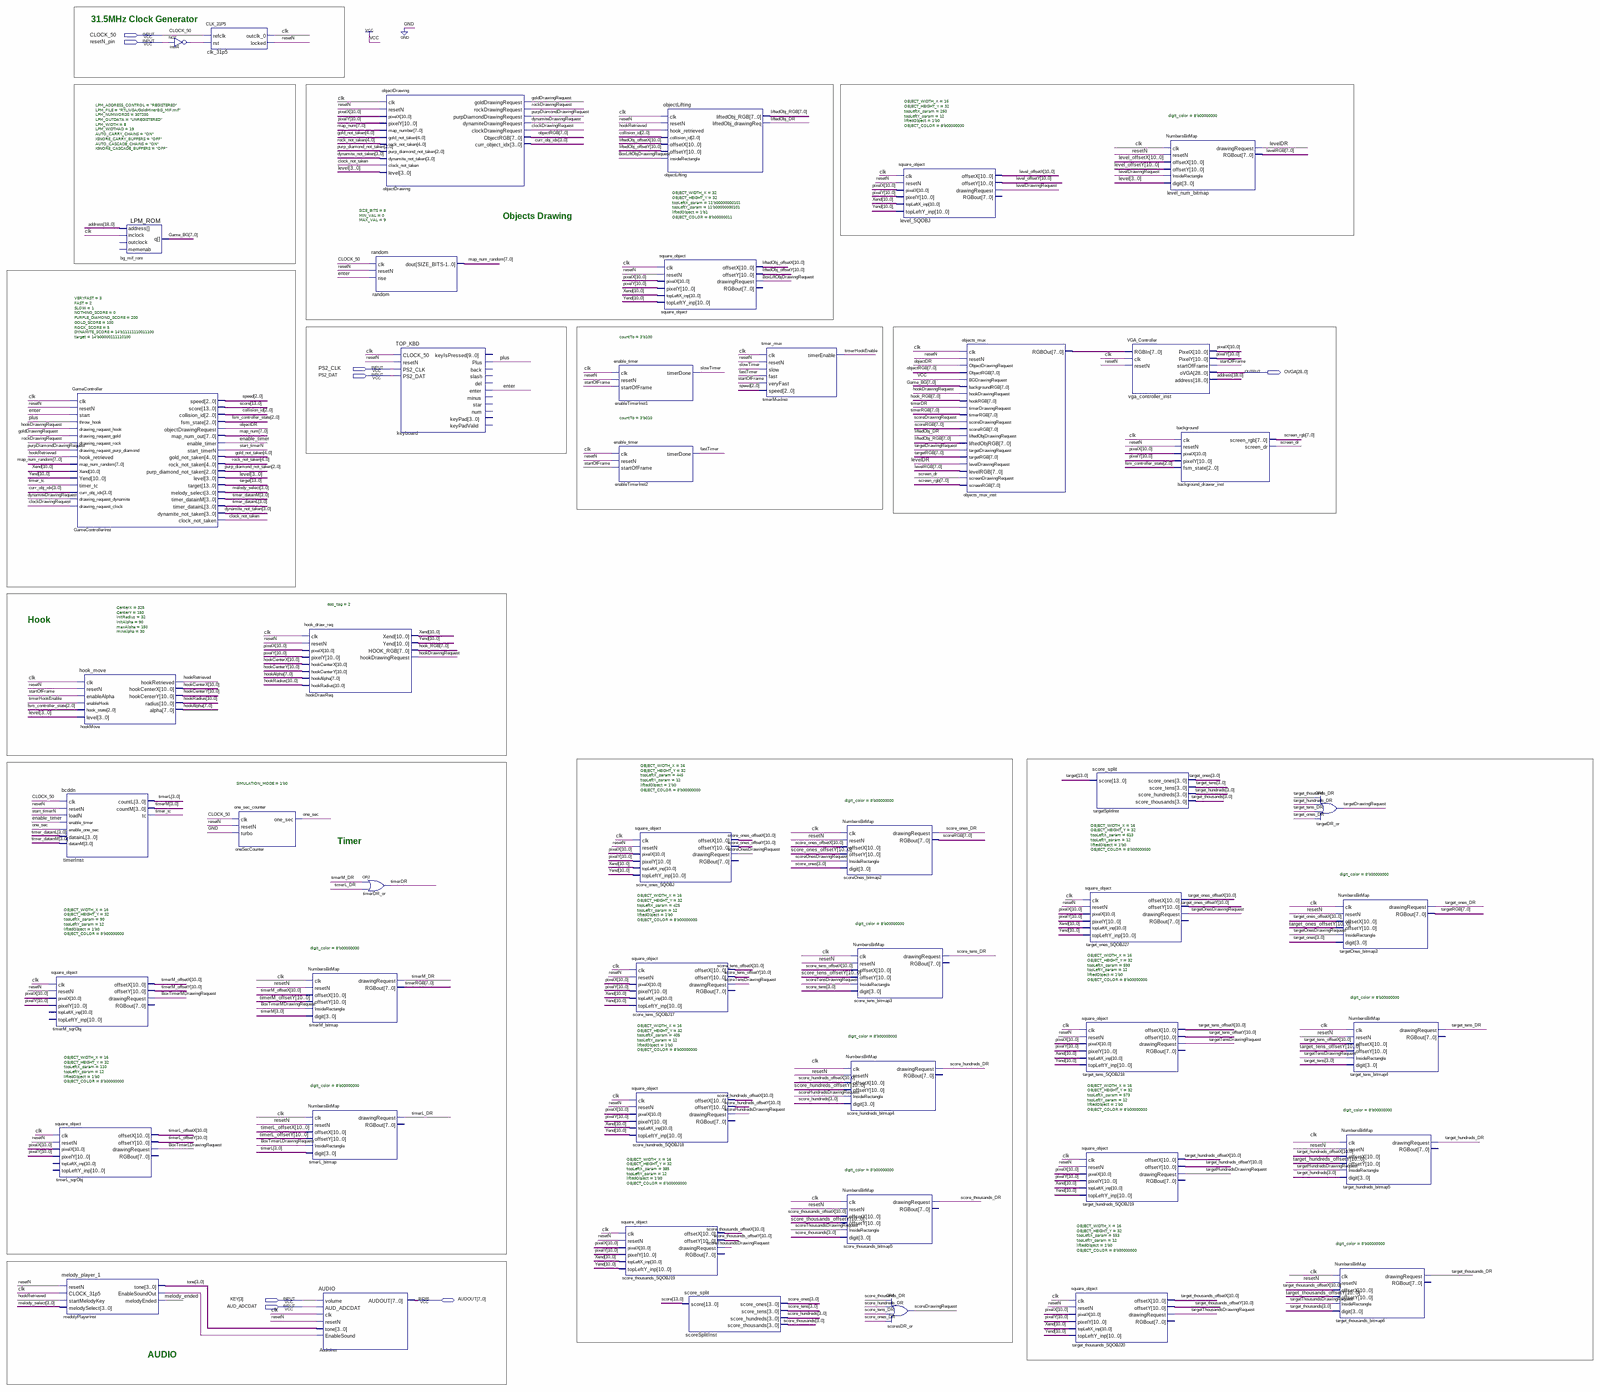
[diagram p0: schematic sheet, whole]
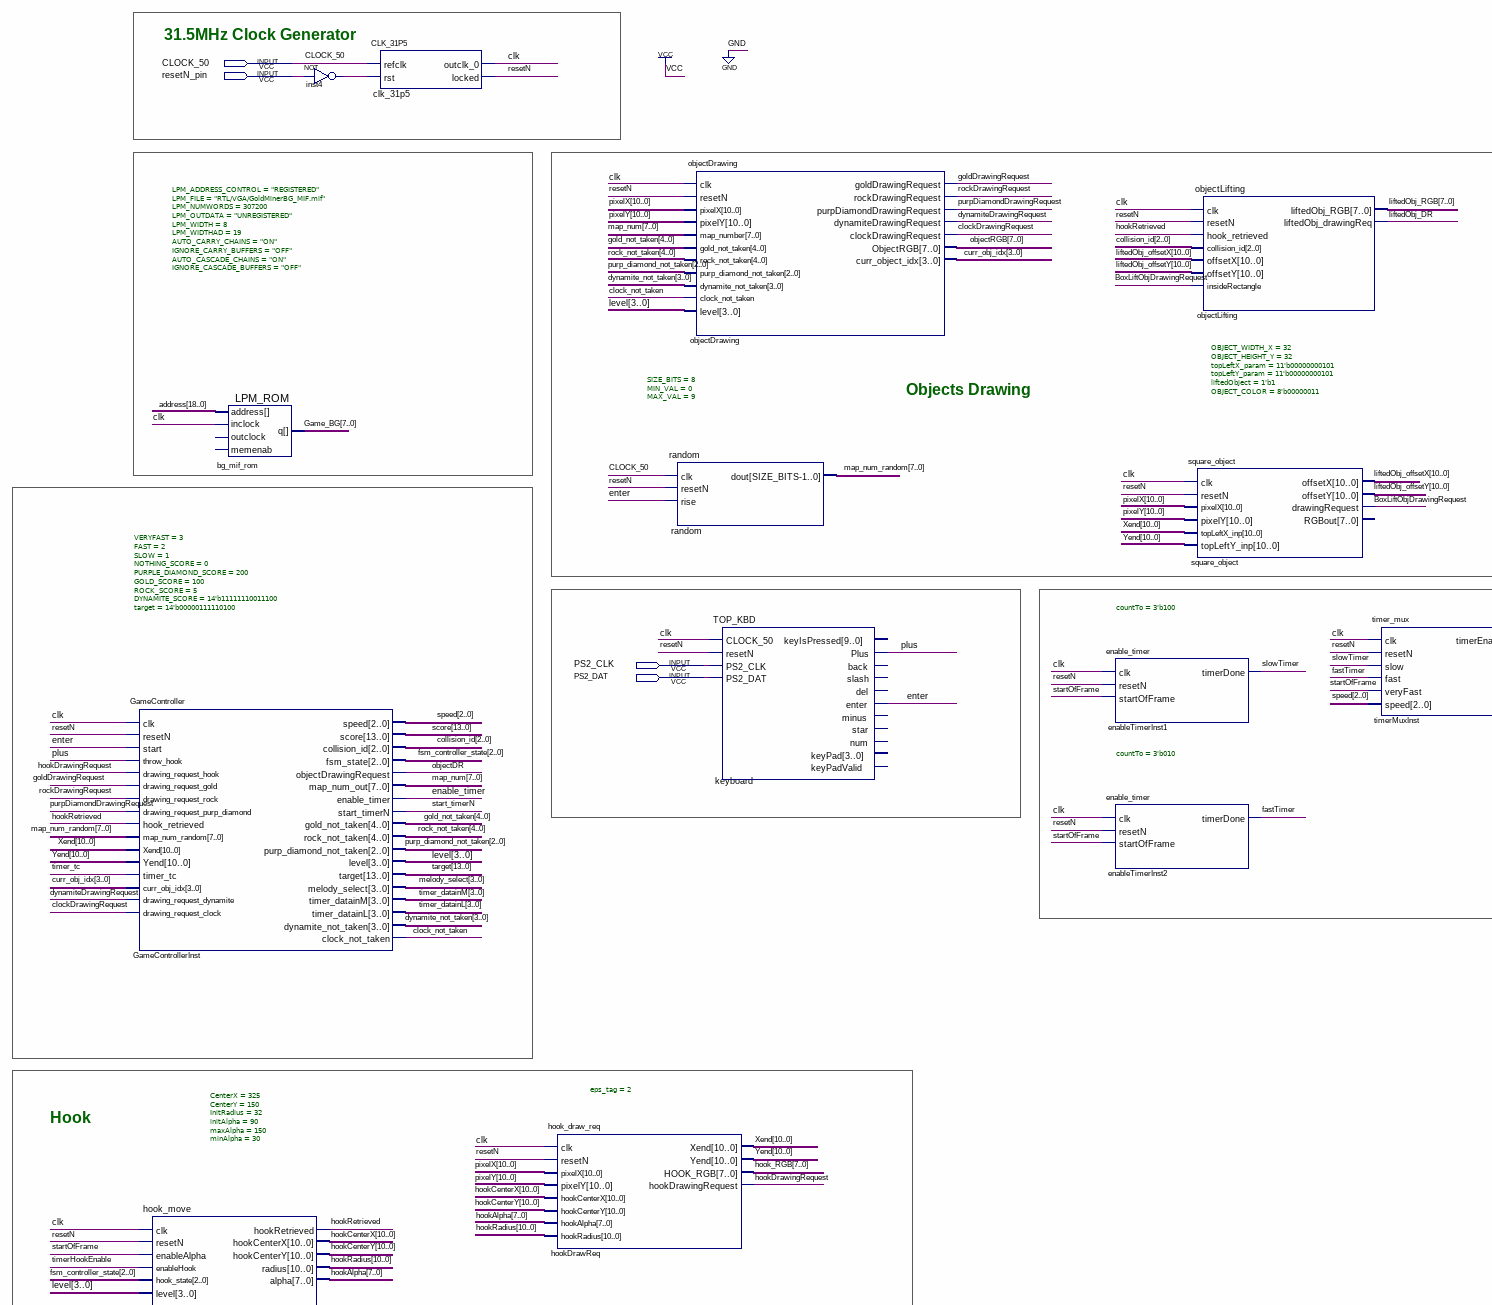
[diagram p1: schematic sheet, upper left part]
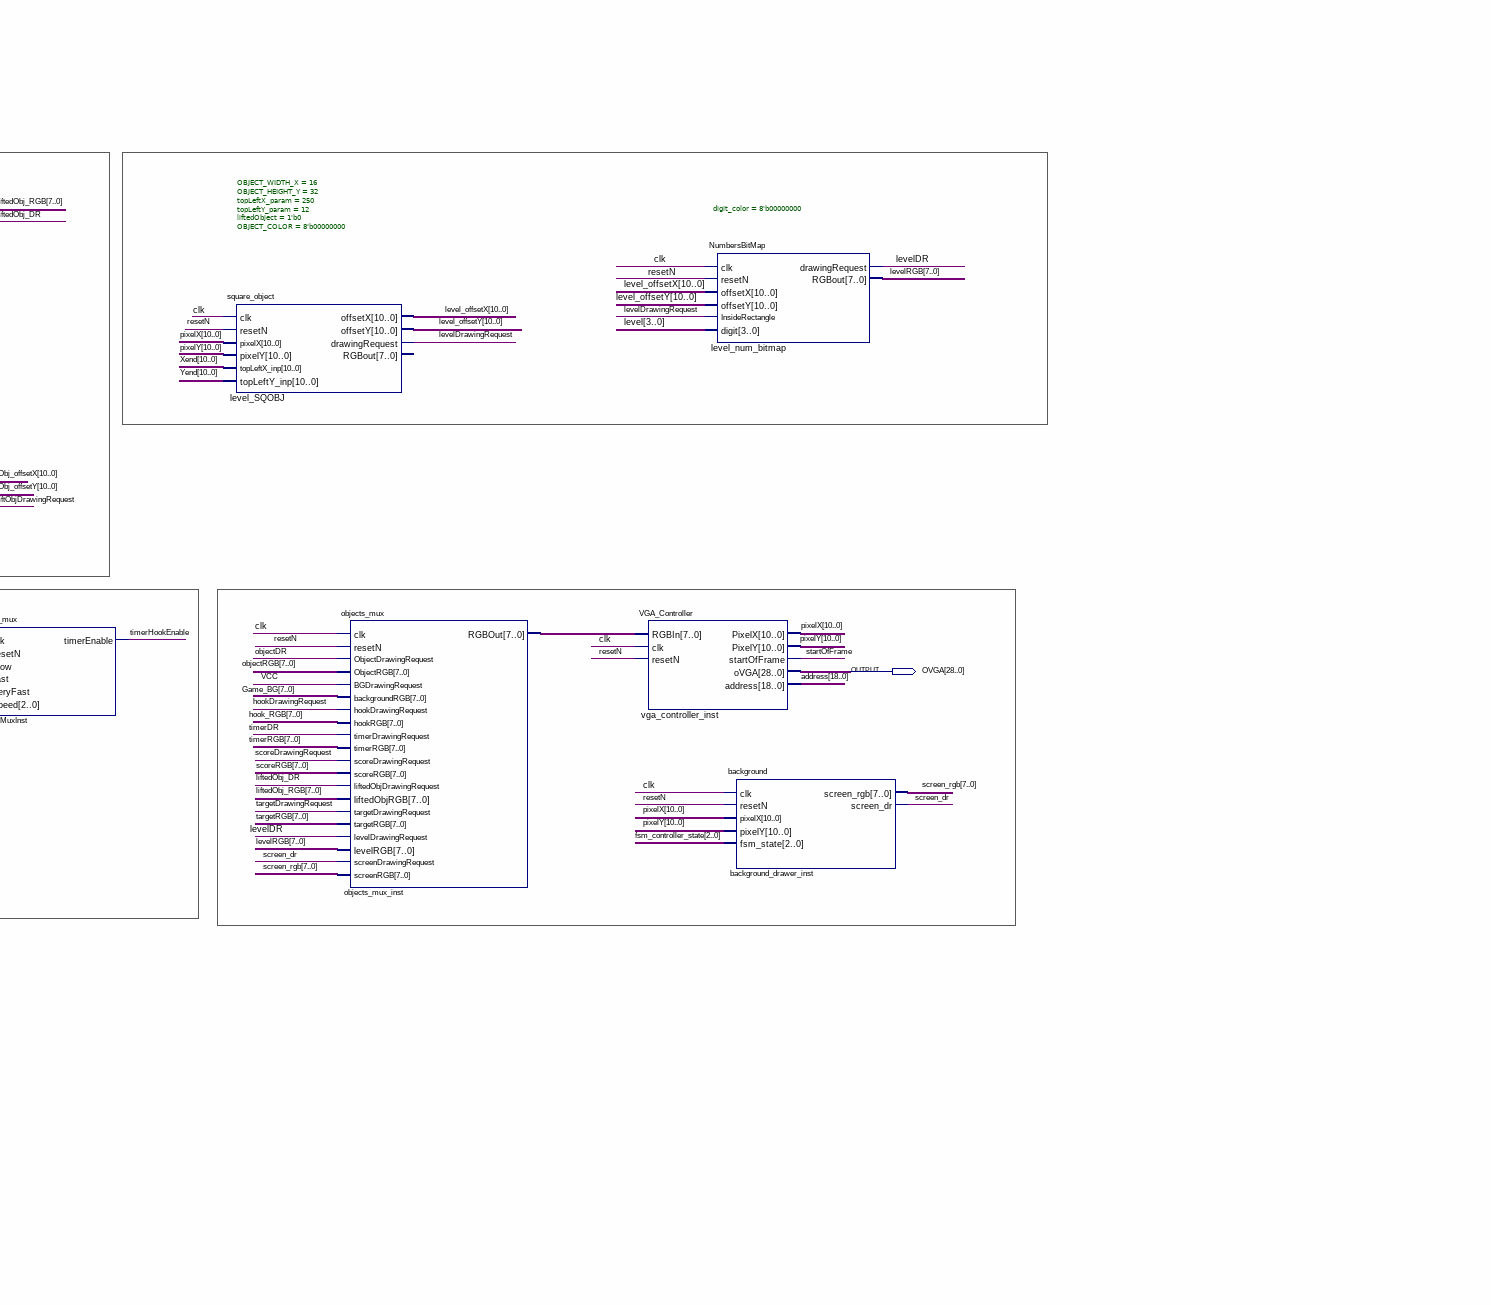
[diagram p2: schematic sheet, upper right part]
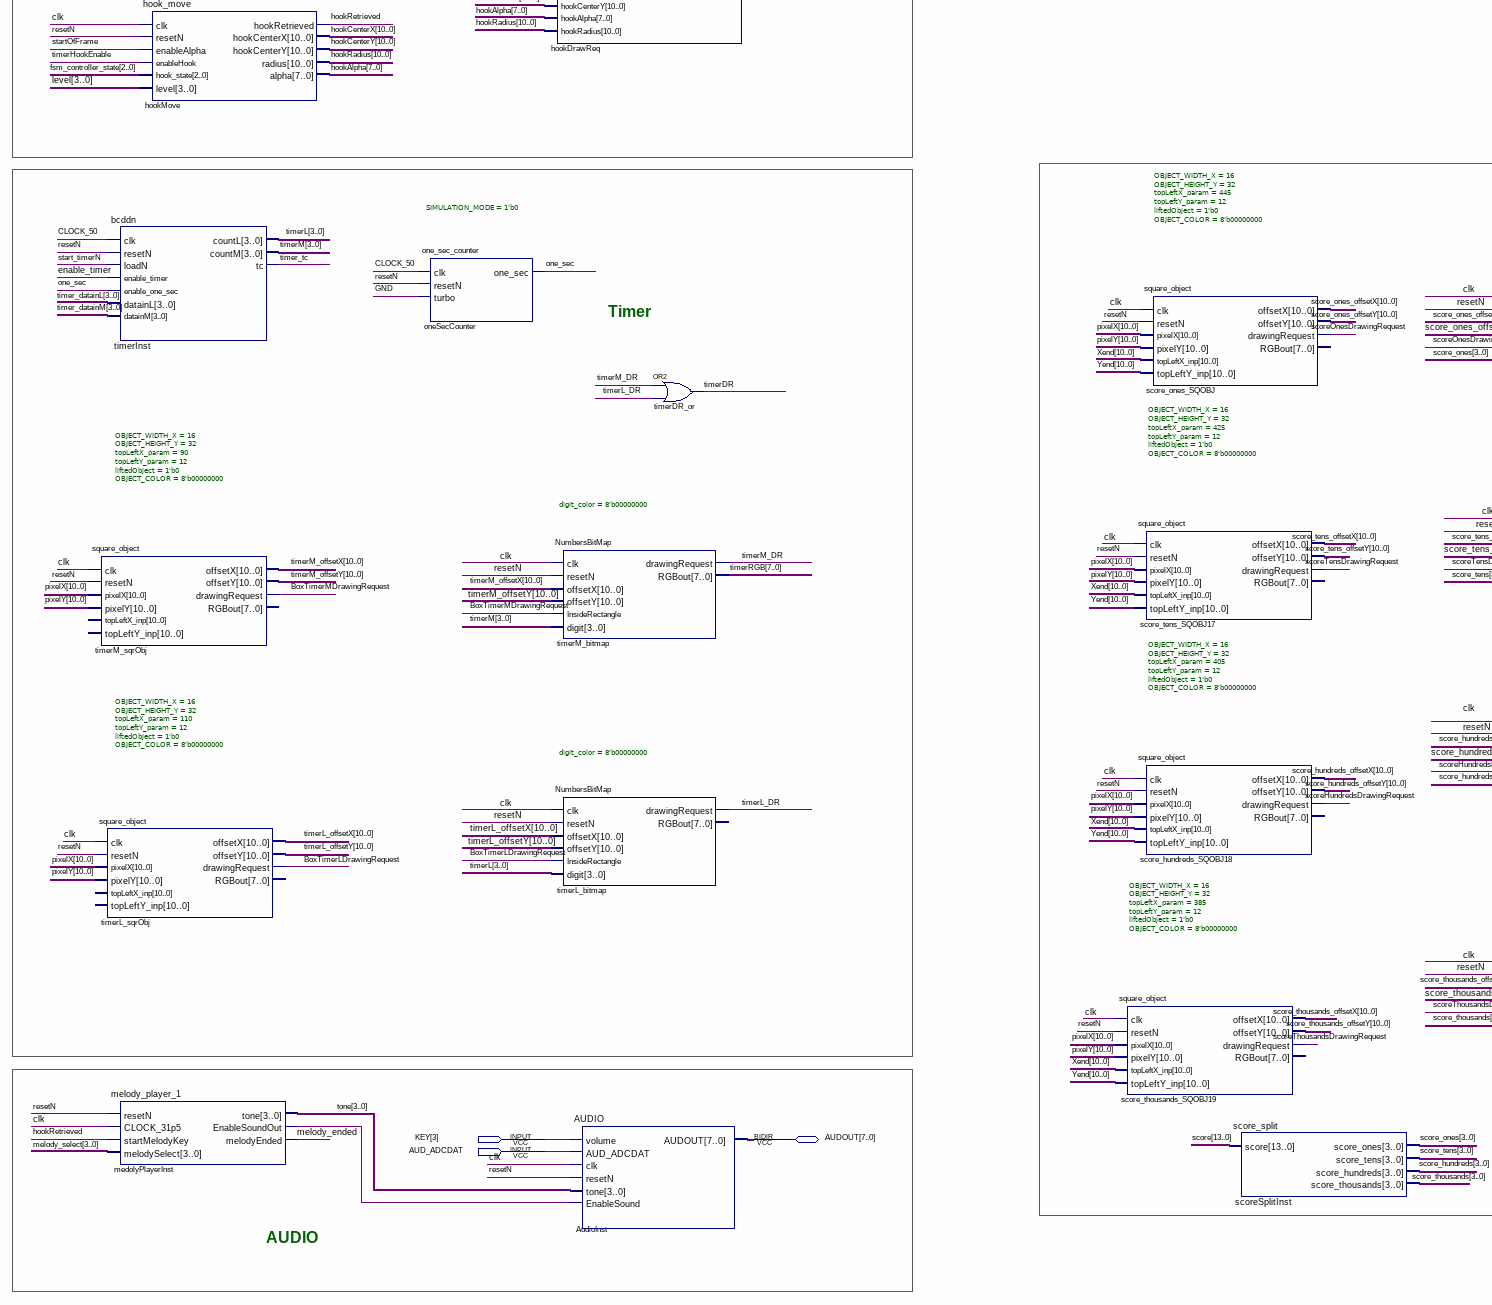
[diagram p3: schematic sheet, lower left part]
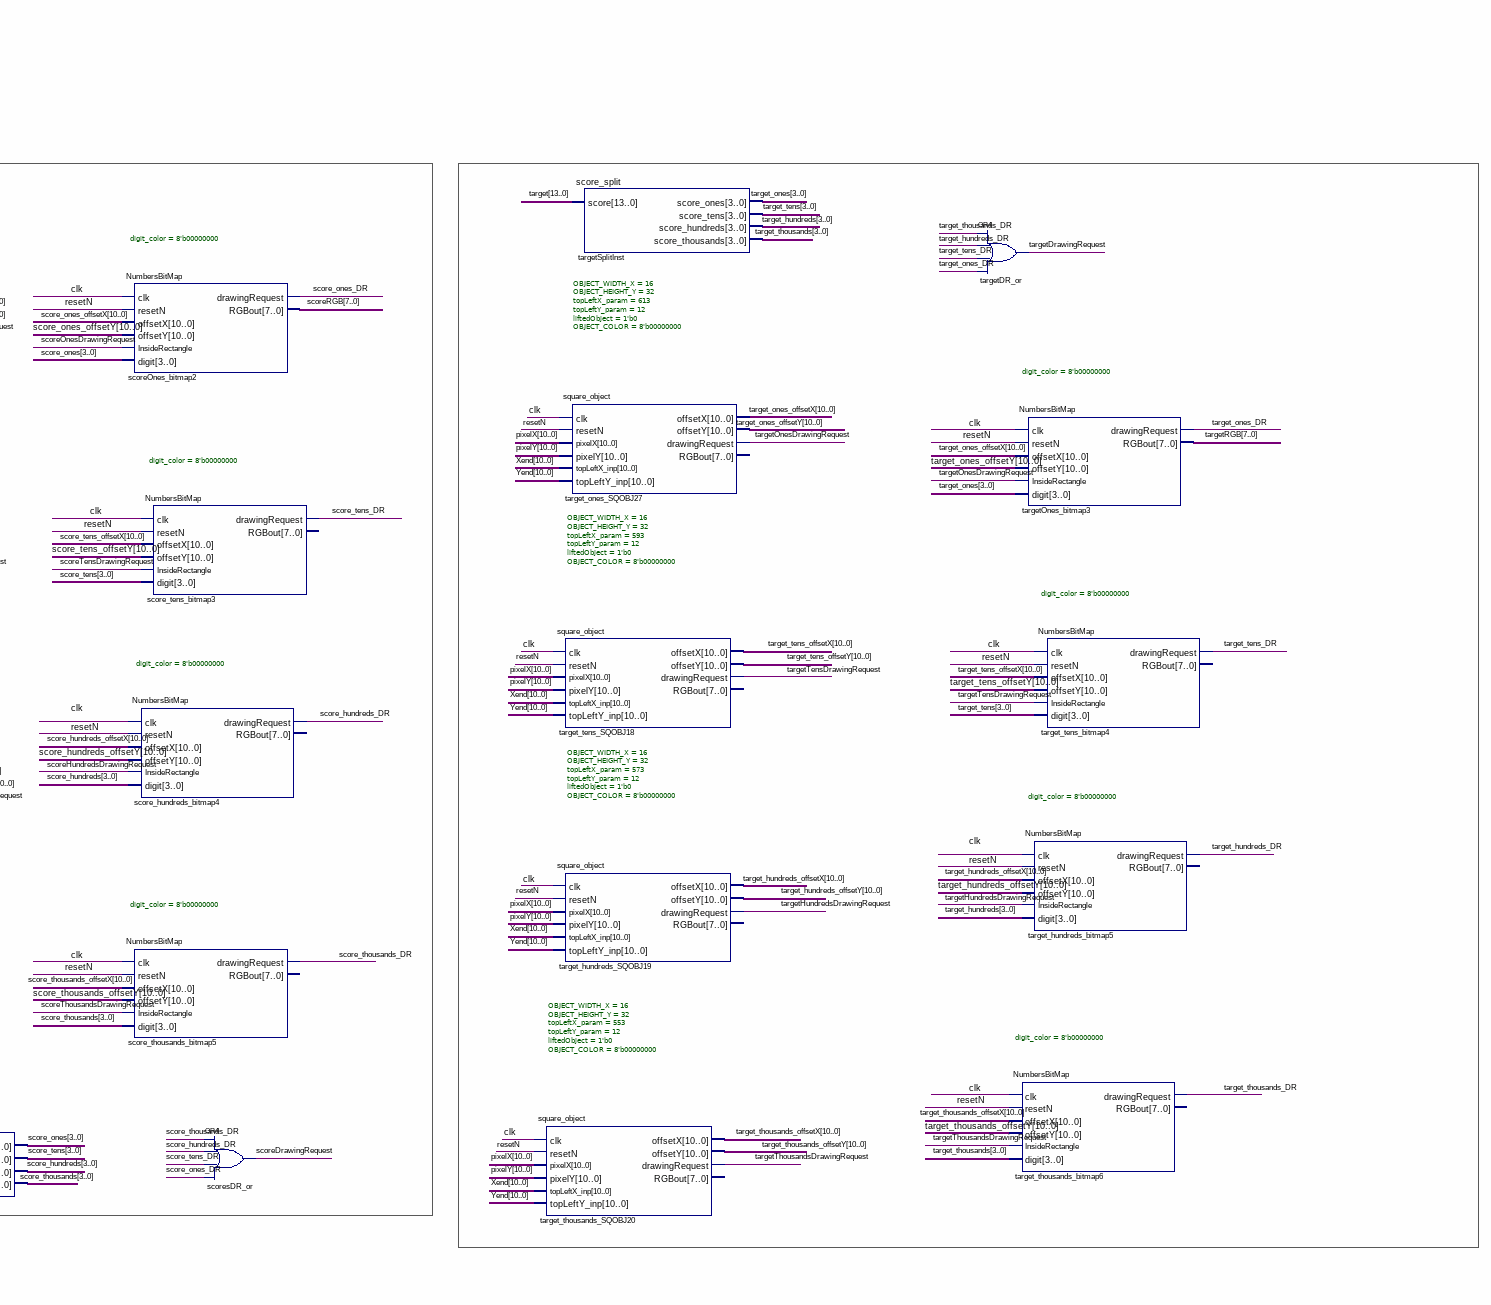
[diagram p4: schematic sheet, lower right part]
// Quartus schematic TOP.bdf as structural Verilog: 48 symbols, 8 pins
module TOP (
  input  CLOCK_50,
  input  resetN_pin,
  input  PS2_CLK,
  input  PS2_DAT,
  input  [3:3] KEY,
  input  AUD_ADCDAT,
  inout  [7:0] AUDOUT,
  output [28:0] OVGA
);

  wire BoxLiftObjDrawingRequest, BoxTimerLDrawingRequest, BoxTimerMDrawingRequest, clk, clock_not_taken,
       clockDrawingRequest, dynamiteDrawingRequest, enable_timer, enter, fastTimer, goldDrawingRequest,
       hookDrawingRequest, hookRetrieved, inst4_out, levelDR, levelDrawingRequest, liftedObj_DR,
       medolyPlayerInst_enablesoundout, melody_ended, objectDR, one_sec, plus, purpDiamondDrawingRequest,
       resetN, rockDrawingRequest, score_hundreds_DR, score_ones_DR, score_tens_DR, score_thousands_DR,
       scoreDrawingRequest, scoreHundredsDrawingRequest, scoreOnesDrawingRequest, scoreTensDrawingRequest,
       scoreThousandsDrawingRequest, screen_dr, slowTimer, start_timerN, startOfFrame, target_hundreds_DR,
       target_ones_DR, target_tens_DR, target_thousands_DR, targetDrawingRequest,
       targetHundredsDrawingRequest, targetOnesDrawingRequest, targetTensDrawingRequest,
       targetThousandsDrawingRequest, timer_tc, timerDR, timerHookEnable, timerL_DR, timerM_DR;
  wire [2:0] collision_id, fsm_controller_state, purp_diamond_not_taken, speed;
  wire [3:0] curr_obj_idx, dynamite_not_taken, level, melody_select, score_hundreds, score_ones, score_tens,
       score_thousands, target_hundreds, target_ones, target_tens, target_thousands, timer_datainL,
       timer_datainM, timerL, timerM, tone;
  wire [4:0] gold_not_taken, rock_not_taken;
  wire [7:0] Game_BG, hook_RGB, hookAlpha, levelRGB, liftedObj_RGB, map_num, map_num_random, objectRGB,
       objects_mux_inst_rgbout, scoreRGB, screen_rgb, targetRGB, timerRGB;
  wire [10:0] hookCenterX, hookCenterY, hookRadius, level_offsetX, level_offsetY, liftedObj_offsetX,
       liftedObj_offsetY, pixelX, pixelY, score_hundreds_offsetX, score_hundreds_offsetY, score_ones_offsetX,
       score_ones_offsetY, score_tens_offsetX, score_tens_offsetY, score_thousands_offsetX,
       score_thousands_offsetY, target_hundreds_offsetX, target_hundreds_offsetY, target_ones_offsetX,
       target_ones_offsetY, target_tens_offsetX, target_tens_offsetY, target_thousands_offsetX,
       target_thousands_offsetY, timerL_offsetX, timerL_offsetY, timerM_offsetX, timerM_offsetY, Xend, Yend;
  wire [13:0] score, target;
  wire [18:0] address;

  square_object #(.OBJECT_WIDTH_X(16), .OBJECT_HEIGHT_Y(32), .topLeftX_param(90), .topLeftY_param(12), .liftedObject(1'b0), .OBJECT_COLOR(8'b00000000)) timerM_sqrObj (
    .clk(clk), .resetN(resetN), .pixelX(pixelX), .pixelY(pixelY), .offsetX(timerM_offsetX),
    .offsetY(timerM_offsetY), .drawingRequest(BoxTimerMDrawingRequest));  // open: topLeftX_inp, topLeftY_inp, RGBout
  square_object #(.OBJECT_WIDTH_X(16), .OBJECT_HEIGHT_Y(32), .topLeftX_param(110), .topLeftY_param(12), .liftedObject(1'b0), .OBJECT_COLOR(8'b00000000)) timerL_sqrObj (
    .clk(clk), .resetN(resetN), .pixelX(pixelX), .pixelY(pixelY), .offsetX(timerL_offsetX),
    .offsetY(timerL_offsetY), .drawingRequest(BoxTimerLDrawingRequest));  // open: topLeftX_inp, topLeftY_inp, RGBout
  GameController #(.VERYFAST(3), .FAST(2), .SLOW(1), .NOTHING_SCORE(0), .PURPLE_DIAMOND_SCORE(200), .GOLD_SCORE(100), .ROCK_SCORE(5), .DYNAMITE_SCORE(14'b11111110011100), .target(14'b00000111110100)) GameControllerInst (
    .clk(clk), .resetN(resetN), .start(enter), .throw_hook(plus), .drawing_request_hook(hookDrawingRequest),
    .drawing_request_gold(goldDrawingRequest), .drawing_request_rock(rockDrawingRequest),
    .drawing_request_purp_diamond(purpDiamondDrawingRequest), .hook_retrieved(hookRetrieved),
    .map_num_random(map_num_random), .Xend(Xend), .Yend(Yend), .timer_tc(timer_tc),
    .curr_obj_idx(curr_obj_idx), .drawing_request_dynamite(dynamiteDrawingRequest),
    .drawing_request_clock(clockDrawingRequest), .speed(speed), .score(score), .collision_id(collision_id),
    .fsm_state(fsm_controller_state), .objectDrawingRequest(objectDR), .map_num_out(map_num),
    .enable_timer(enable_timer), .start_timerN(start_timerN), .gold_not_taken(gold_not_taken),
    .rock_not_taken(rock_not_taken), .purp_diamond_not_taken(purp_diamond_not_taken), .level(level),
    .target(target), .melody_select(melody_select), .timer_datainM(timer_datainM),
    .timer_datainL(timer_datainL), .dynamite_not_taken(dynamite_not_taken), .clock_not_taken(clock_not_taken));
  hook_move #(.CenterX(325), .CenterY(150), .InitRadius(32), .initAlpha(90), .maxAlpha(150), .minAlpha(30)) hookMove (
    .clk(clk), .resetN(resetN), .enableAlpha(startOfFrame), .enableHook(timerHookEnable),
    .hook_state(fsm_controller_state), .level(level), .hookRetrieved(hookRetrieved),
    .hookCenterX(hookCenterX), .hookCenterY(hookCenterY), .radius(hookRadius), .alpha(hookAlpha));
  bcddn timerInst (
    .clk(CLOCK_50), .resetN(resetN), .loadN(start_timerN), .enable_timer(enable_timer),
    .enable_one_sec(one_sec), .datainL(timer_datainL), .datainM(timer_datainM), .countL(timerL),
    .countM(timerM), .tc(timer_tc));
  melody_player_1 medolyPlayerInst (
    .resetN(resetN), .CLOCK_31p5(clk), .startMelodyKey(hookRetrieved), .melodySelect(melody_select),
    .tone(tone), .EnableSoundOut(medolyPlayerInst_enablesoundout), .melodyEnded(melody_ended));
  LPM_ROM #(.LPM_ADDRESS_CONTROL("REGISTERED"), .LPM_FILE("RTL/VGA/GoldMinerBG_MIF.mif"), .LPM_NUMWORDS(307200), .LPM_OUTDATA("UNREGISTERED"), .LPM_WIDTH(8), .LPM_WIDTHAD(19), .AUTO_CARRY_CHAINS("ON"), .IGNORE_CARRY_BUFFERS("OFF"), .AUTO_CASCADE_CHAINS("ON"), .IGNORE_CASCADE_BUFFERS("OFF")) bg_mif_rom (
    .address(address), .inclock(clk), .q(Game_BG));  // open: outclock, memenab
  not inst4 (inst4_out, resetN_pin);
  CLK_31P5 clk_31p5 (.refclk(CLOCK_50), .rst(inst4_out), .outclk_0(clk), .locked(resetN));
  one_sec_counter #(.SIMULATION_MODE(1'b0)) oneSecCounter (
    .clk(CLOCK_50), .resetN(resetN), .turbo(1'b0), .one_sec(one_sec));
  hook_draw_req #(.eps_tag(2)) hookDrawReq (
    .clk(clk), .resetN(resetN), .pixelX(pixelX), .pixelY(pixelY), .hookCenterX(hookCenterX),
    .hookCenterY(hookCenterY), .hookAlpha(hookAlpha), .hookRadius(hookRadius), .Xend(Xend), .Yend(Yend),
    .HOOK_RGB(hook_RGB), .hookDrawingRequest(hookDrawingRequest));
  NumbersBitMap #(.digit_color(8'b00000000)) timerM_bitmap (
    .clk(clk), .resetN(resetN), .offsetX(timerM_offsetX), .offsetY(timerM_offsetY),
    .InsideRectangle(BoxTimerMDrawingRequest), .digit(timerM), .drawingRequest(timerM_DR), .RGBout(timerRGB));
  NumbersBitMap #(.digit_color(8'b00000000)) timerL_bitmap (
    .clk(clk), .resetN(resetN), .offsetX(timerL_offsetX), .offsetY(timerL_offsetY),
    .InsideRectangle(BoxTimerLDrawingRequest), .digit(timerL), .drawingRequest(timerL_DR));  // open: RGBout
  AUDIO AudioInst (
    .volume(KEY[3]), .AUD_ADCDAT(AUD_ADCDAT), .clk(clk), .resetN(resetN), .tone(tone),
    .EnableSound(medolyPlayerInst_enablesoundout), .AUDOUT(AUDOUT));
  or timerDR_or (timerDR, timerM_DR, timerL_DR);
  objectDrawing objectDrawing (
    .clk(clk), .resetN(resetN), .pixelX(pixelX), .pixelY(pixelY), .map_number(map_num),
    .gold_not_taken(gold_not_taken), .rock_not_taken(rock_not_taken),
    .purp_diamond_not_taken(purp_diamond_not_taken), .dynamite_not_taken(dynamite_not_taken),
    .clock_not_taken(clock_not_taken), .level(level), .goldDrawingRequest(goldDrawingRequest),
    .rockDrawingRequest(rockDrawingRequest), .purpDiamondDrawingRequest(purpDiamondDrawingRequest),
    .dynamiteDrawingRequest(dynamiteDrawingRequest), .clockDrawingRequest(clockDrawingRequest),
    .ObjectRGB(objectRGB), .curr_object_idx(curr_obj_idx));
  random #(.SIZE_BITS(8), .MIN_VAL(0), .MAX_VAL(9)) random (
    .clk(CLOCK_50), .resetN(resetN), .rise(enter), .dout(map_num_random));
  TOP_KBD keyboard (
    .CLOCK_50(clk), .resetN(resetN), .PS2_CLK(PS2_CLK), .PS2_DAT(PS2_DAT), .Plus(plus), .enter(enter));  // open: keyIsPressed, back, slash, del, minus, star, num, keyPad, keyPadValid
  enable_timer #(.countTo(3'b100)) enableTimerInst1 (
    .clk(clk), .resetN(resetN), .startOfFrame(startOfFrame), .timerDone(slowTimer));
  enable_timer #(.countTo(3'b010)) enableTimerInst2 (
    .clk(clk), .resetN(resetN), .startOfFrame(startOfFrame), .timerDone(fastTimer));
  square_object #(.OBJECT_WIDTH_X(16), .OBJECT_HEIGHT_Y(32), .topLeftX_param(445), .topLeftY_param(12), .liftedObject(1'b0), .OBJECT_COLOR(8'b00000000)) score_ones_SQOBJ (
    .clk(clk), .resetN(resetN), .pixelX(pixelX), .pixelY(pixelY), .topLeftX_inp(Xend), .topLeftY_inp(Yend),
    .offsetX(score_ones_offsetX), .offsetY(score_ones_offsetY), .drawingRequest(scoreOnesDrawingRequest));  // open: RGBout
  square_object #(.OBJECT_WIDTH_X(16), .OBJECT_HEIGHT_Y(32), .topLeftX_param(425), .topLeftY_param(12), .liftedObject(1'b0), .OBJECT_COLOR(8'b00000000)) score_tens_SQOBJ17 (
    .clk(clk), .resetN(resetN), .pixelX(pixelX), .pixelY(pixelY), .topLeftX_inp(Xend), .topLeftY_inp(Yend),
    .offsetX(score_tens_offsetX), .offsetY(score_tens_offsetY), .drawingRequest(scoreTensDrawingRequest));  // open: RGBout
  square_object #(.OBJECT_WIDTH_X(16), .OBJECT_HEIGHT_Y(32), .topLeftX_param(405), .topLeftY_param(12), .liftedObject(1'b0), .OBJECT_COLOR(8'b00000000)) score_hundreds_SQOBJ18 (
    .clk(clk), .resetN(resetN), .pixelX(pixelX), .pixelY(pixelY), .topLeftX_inp(Xend), .topLeftY_inp(Yend),
    .offsetX(score_hundreds_offsetX), .offsetY(score_hundreds_offsetY),
    .drawingRequest(scoreHundredsDrawingRequest));  // open: RGBout
  square_object #(.OBJECT_WIDTH_X(16), .OBJECT_HEIGHT_Y(32), .topLeftX_param(385), .topLeftY_param(12), .liftedObject(1'b0), .OBJECT_COLOR(8'b00000000)) score_thousands_SQOBJ19 (
    .clk(clk), .resetN(resetN), .pixelX(pixelX), .pixelY(pixelY), .topLeftX_inp(Xend), .topLeftY_inp(Yend),
    .offsetX(score_thousands_offsetX), .offsetY(score_thousands_offsetY),
    .drawingRequest(scoreThousandsDrawingRequest));  // open: RGBout
  objectLifting objectLifting (
    .clk(clk), .resetN(resetN), .hook_retrieved(hookRetrieved), .collision_id(collision_id),
    .offsetX(liftedObj_offsetX), .offsetY(liftedObj_offsetY), .insideRectangle(BoxLiftObjDrawingRequest),
    .liftedObj_RGB(liftedObj_RGB), .liftedObj_drawingReq(liftedObj_DR));
  square_object #(.OBJECT_WIDTH_X(32), .OBJECT_HEIGHT_Y(32), .topLeftX_param(11'b00000000101), .topLeftY_param(11'b00000000101), .liftedObject(1'b1), .OBJECT_COLOR(8'b00000011)) square_object (
    .clk(clk), .resetN(resetN), .pixelX(pixelX), .pixelY(pixelY), .topLeftX_inp(Xend), .topLeftY_inp(Yend),
    .offsetX(liftedObj_offsetX), .offsetY(liftedObj_offsetY), .drawingRequest(BoxLiftObjDrawingRequest));  // open: RGBout
  score_split scoreSplitInst (
    .score(score), .score_ones(score_ones), .score_tens(score_tens), .score_hundreds(score_hundreds),
    .score_thousands(score_thousands));
  timer_mux timerMuxInst (
    .clk(clk), .resetN(resetN), .slow(slowTimer), .fast(fastTimer), .veryFast(startOfFrame), .speed(speed),
    .timerEnable(timerHookEnable));
  NumbersBitMap #(.digit_color(8'b00000000)) scoreOnes_bitmap2 (
    .clk(clk), .resetN(resetN), .offsetX(score_ones_offsetX), .offsetY(score_ones_offsetY),
    .InsideRectangle(scoreOnesDrawingRequest), .digit(score_ones), .drawingRequest(score_ones_DR),
    .RGBout(scoreRGB));
  NumbersBitMap #(.digit_color(8'b00000000)) score_thousands_bitmap5 (
    .clk(clk), .resetN(resetN), .offsetX(score_thousands_offsetX), .offsetY(score_thousands_offsetY),
    .InsideRectangle(scoreThousandsDrawingRequest), .digit(score_thousands),
    .drawingRequest(score_thousands_DR));  // open: RGBout
  NumbersBitMap #(.digit_color(8'b00000000)) score_tens_bitmap3 (
    .clk(clk), .resetN(resetN), .offsetX(score_tens_offsetX), .offsetY(score_tens_offsetY),
    .InsideRectangle(scoreTensDrawingRequest), .digit(score_tens), .drawingRequest(score_tens_DR));  // open: RGBout
  NumbersBitMap #(.digit_color(8'b00000000)) score_hundreds_bitmap4 (
    .clk(clk), .resetN(resetN), .offsetX(score_hundreds_offsetX), .offsetY(score_hundreds_offsetY),
    .InsideRectangle(scoreHundredsDrawingRequest), .digit(score_hundreds), .drawingRequest(score_hundreds_DR));  // open: RGBout
  square_object #(.OBJECT_WIDTH_X(16), .OBJECT_HEIGHT_Y(32), .topLeftX_param(250), .topLeftY_param(12), .liftedObject(1'b0), .OBJECT_COLOR(8'b00000000)) level_SQOBJ (
    .clk(clk), .resetN(resetN), .pixelX(pixelX), .pixelY(pixelY), .topLeftX_inp(Xend), .topLeftY_inp(Yend),
    .offsetX(level_offsetX), .offsetY(level_offsetY), .drawingRequest(levelDrawingRequest));  // open: RGBout
  or scoresDR_or (scoreDrawingRequest, score_thousands_DR, score_hundreds_DR, score_tens_DR, score_ones_DR);
  objects_mux objects_mux_inst (
    .clk(clk), .resetN(resetN), .ObjectDrawingRequest(objectDR), .ObjectRGB(objectRGB),
    .BGDrawingRequest(1'b1), .backgroundRGB(Game_BG), .hookDrawingRequest(hookDrawingRequest),
    .hookRGB(hook_RGB), .timerDrawingRequest(timerDR), .timerRGB(timerRGB),
    .scoreDrawingRequest(scoreDrawingRequest), .scoreRGB(scoreRGB), .liftedObjDrawingRequest(liftedObj_DR),
    .liftedObjRGB(liftedObj_RGB), .targetDrawingRequest(targetDrawingRequest), .targetRGB(targetRGB),
    .levelDrawingRequest(levelDR), .levelRGB(levelRGB), .screenDrawingRequest(screen_dr),
    .screenRGB(screen_rgb), .RGBOut(objects_mux_inst_rgbout));
  score_split targetSplitInst (
    .score(target), .score_ones(target_ones), .score_tens(target_tens), .score_hundreds(target_hundreds),
    .score_thousands(target_thousands));
  square_object #(.OBJECT_WIDTH_X(16), .OBJECT_HEIGHT_Y(32), .topLeftX_param(613), .topLeftY_param(12), .liftedObject(1'b0), .OBJECT_COLOR(8'b00000000)) target_ones_SQOBJ27 (
    .clk(clk), .resetN(resetN), .pixelX(pixelX), .pixelY(pixelY), .topLeftX_inp(Xend), .topLeftY_inp(Yend),
    .offsetX(target_ones_offsetX), .offsetY(target_ones_offsetY), .drawingRequest(targetOnesDrawingRequest));  // open: RGBout
  square_object #(.OBJECT_WIDTH_X(16), .OBJECT_HEIGHT_Y(32), .topLeftX_param(593), .topLeftY_param(12), .liftedObject(1'b0), .OBJECT_COLOR(8'b00000000)) target_tens_SQOBJ18 (
    .clk(clk), .resetN(resetN), .pixelX(pixelX), .pixelY(pixelY), .topLeftX_inp(Xend), .topLeftY_inp(Yend),
    .offsetX(target_tens_offsetX), .offsetY(target_tens_offsetY), .drawingRequest(targetTensDrawingRequest));  // open: RGBout
  square_object #(.OBJECT_WIDTH_X(16), .OBJECT_HEIGHT_Y(32), .topLeftX_param(573), .topLeftY_param(12), .liftedObject(1'b0), .OBJECT_COLOR(8'b00000000)) target_hundreds_SQOBJ19 (
    .clk(clk), .resetN(resetN), .pixelX(pixelX), .pixelY(pixelY), .topLeftX_inp(Xend), .topLeftY_inp(Yend),
    .offsetX(target_hundreds_offsetX), .offsetY(target_hundreds_offsetY),
    .drawingRequest(targetHundredsDrawingRequest));  // open: RGBout
  square_object #(.OBJECT_WIDTH_X(16), .OBJECT_HEIGHT_Y(32), .topLeftX_param(553), .topLeftY_param(12), .liftedObject(1'b0), .OBJECT_COLOR(8'b00000000)) target_thousands_SQOBJ20 (
    .clk(clk), .resetN(resetN), .pixelX(pixelX), .pixelY(pixelY), .topLeftX_inp(Xend), .topLeftY_inp(Yend),
    .offsetX(target_thousands_offsetX), .offsetY(target_thousands_offsetY),
    .drawingRequest(targetThousandsDrawingRequest));  // open: RGBout
  VGA_Controller vga_controller_inst (
    .RGBIn(objects_mux_inst_rgbout), .clk(clk), .resetN(resetN), .PixelX(pixelX), .PixelY(pixelY),
    .startOfFrame(startOfFrame), .oVGA(OVGA), .address(address));
  NumbersBitMap #(.digit_color(8'b00000000)) level_num_bitmap (
    .clk(clk), .resetN(resetN), .offsetX(level_offsetX), .offsetY(level_offsetY),
    .InsideRectangle(levelDrawingRequest), .digit(level), .drawingRequest(levelDR), .RGBout(levelRGB));
  background background_drawer_inst (
    .clk(clk), .resetN(resetN), .pixelX(pixelX), .pixelY(pixelY), .fsm_state(fsm_controller_state),
    .screen_rgb(screen_rgb), .screen_dr(screen_dr));
  or targetDR_or (targetDrawingRequest, target_thousands_DR, target_hundreds_DR, target_tens_DR, target_ones_DR);
  NumbersBitMap #(.digit_color(8'b00000000)) targetOnes_bitmap3 (
    .clk(clk), .resetN(resetN), .offsetX(target_ones_offsetX), .offsetY(target_ones_offsetY),
    .InsideRectangle(targetOnesDrawingRequest), .digit(target_ones), .drawingRequest(target_ones_DR),
    .RGBout(targetRGB));
  NumbersBitMap #(.digit_color(8'b00000000)) target_tens_bitmap4 (
    .clk(clk), .resetN(resetN), .offsetX(target_tens_offsetX), .offsetY(target_tens_offsetY),
    .InsideRectangle(targetTensDrawingRequest), .digit(target_tens), .drawingRequest(target_tens_DR));  // open: RGBout
  NumbersBitMap #(.digit_color(8'b00000000)) target_hundreds_bitmap5 (
    .clk(clk), .resetN(resetN), .offsetX(target_hundreds_offsetX), .offsetY(target_hundreds_offsetY),
    .InsideRectangle(targetHundredsDrawingRequest), .digit(target_hundreds),
    .drawingRequest(target_hundreds_DR));  // open: RGBout
  NumbersBitMap #(.digit_color(8'b00000000)) target_thousands_bitmap6 (
    .clk(clk), .resetN(resetN), .offsetX(target_thousands_offsetX), .offsetY(target_thousands_offsetY),
    .InsideRectangle(targetThousandsDrawingRequest), .digit(target_thousands),
    .drawingRequest(target_thousands_DR));  // open: RGBout

  // Notes on the sheet:
  //   31.5MHz Clock Generator
  //   Objects Drawing
  //   Hook
  //   Timer
  //   AUDIO
endmodule
